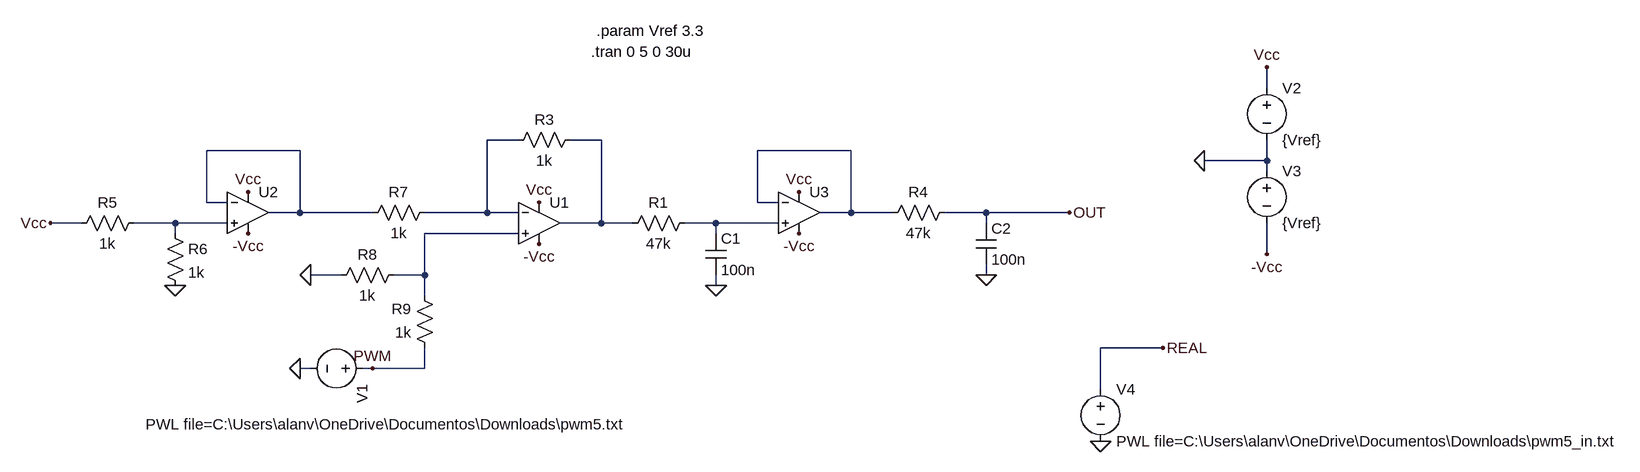
[diagram p0: schematic PWM.asc]
PWM.asc, the LTspice schematic file:
Version 4
SHEET 1 1380 880
WIRE 736 -64 736 -96
WIRE -416 16 -464 16
WIRE -288 16 -336 16
WIRE -752 32 -896 32
WIRE 96 32 -48 32
WIRE 736 48 736 16
WIRE 736 48 640 48
WIRE 736 64 736 48
WIRE -896 112 -896 32
WIRE -864 112 -896 112
WIRE -48 112 -48 32
WIRE -16 112 -48 112
WIRE -752 128 -752 32
WIRE -752 128 -800 128
WIRE -640 128 -752 128
WIRE -464 128 -464 16
WIRE -464 128 -560 128
WIRE -416 128 -464 128
WIRE 96 128 96 32
WIRE 96 128 48 128
WIRE 160 128 96 128
WIRE 304 128 240 128
WIRE 432 128 304 128
WIRE -1088 144 -1136 144
WIRE -944 144 -1008 144
WIRE -864 144 -944 144
WIRE -288 144 -288 16
WIRE -288 144 -352 144
WIRE -240 144 -288 144
WIRE -112 144 -160 144
WIRE -16 144 -112 144
WIRE 304 144 304 128
WIRE -944 160 -944 144
WIRE -416 160 -560 160
WIRE -112 160 -112 144
WIRE 736 192 736 144
WIRE -688 224 -736 224
WIRE -560 224 -560 160
WIRE -560 224 -608 224
WIRE 304 224 304 208
WIRE -112 240 -112 224
WIRE -560 256 -560 224
WIRE 576 336 480 336
WIRE -736 368 -752 368
WIRE -640 368 -656 368
WIRE -560 368 -560 336
WIRE -560 368 -640 368
WIRE 480 400 480 336
FLAG -752 368 0
FLAG -112 240 0
FLAG 640 48 0
FLAG 736 -96 Vcc
FLAG -384 112 Vcc
FLAG 736 192 -Vcc
FLAG -384 176 -Vcc
FLAG -832 96 Vcc
FLAG -832 160 -Vcc
FLAG 304 224 0
FLAG 480 480 0
FLAG 576 336 REAL
FLAG -640 368 PWM
FLAG -944 240 0
FLAG -1136 144 Vcc
FLAG 432 128 OUT
FLAG 16 96 Vcc
FLAG 16 160 -Vcc
FLAG -736 224 0
SYMBOL res -144 128 R90
WINDOW 0 0 56 VBottom 2
WINDOW 3 32 56 VTop 2
SYMATTR InstName R1
SYMATTR Value 47k
SYMBOL cap -128 160 R0
SYMATTR InstName C1
SYMATTR Value 100n
SYMBOL voltage -640 368 R90
WINDOW 3 86 -393 VRight 2
WINDOW 123 0 0 Left 0
WINDOW 39 0 0 Left 0
SYMATTR Value PWL file=C:\Users\alanv\OneDrive\Documentos\Downloads\pwm5.txt
SYMATTR InstName V1
SYMBOL OpAmps\\UniversalOpamp2 -384 144 R0
SYMATTR InstName U1
SYMBOL res -320 0 R90
WINDOW 0 0 56 VBottom 2
WINDOW 3 32 56 VTop 2
SYMATTR InstName R3
SYMATTR Value 1k
SYMBOL voltage 736 -80 R0
WINDOW 123 0 0 Left 0
WINDOW 39 0 0 Left 0
SYMATTR InstName V2
SYMATTR Value {Vref}
SYMBOL voltage 736 48 R0
WINDOW 123 0 0 Left 0
WINDOW 39 0 0 Left 0
SYMATTR InstName V3
SYMATTR Value {Vref}
SYMBOL OpAmps\\UniversalOpamp2 -832 128 R0
SYMATTR InstName U2
SYMBOL res 256 112 R90
WINDOW 0 0 56 VBottom 2
WINDOW 3 32 56 VTop 2
SYMATTR InstName R4
SYMATTR Value 47k
SYMBOL cap 288 144 R0
SYMATTR InstName C2
SYMATTR Value 100n
SYMBOL voltage 480 384 R0
WINDOW 123 0 0 Left 0
WINDOW 39 0 0 Left 0
SYMATTR InstName V4
SYMATTR Value PWL file=C:\Users\alanv\OneDrive\Documentos\Downloads\pwm5_in.txt
SYMBOL res -992 128 R90
WINDOW 0 0 56 VBottom 2
WINDOW 3 32 56 VTop 2
SYMATTR InstName R5
SYMATTR Value 1k
SYMBOL res -960 144 R0
SYMATTR InstName R6
SYMATTR Value 1k
SYMBOL res -656 144 R270
WINDOW 0 32 56 VTop 2
WINDOW 3 0 56 VBottom 2
SYMATTR InstName R7
SYMATTR Value 1k
SYMBOL res -592 208 R90
WINDOW 0 0 56 VBottom 2
WINDOW 3 32 56 VTop 2
SYMATTR InstName R8
SYMATTR Value 1k
SYMBOL res -544 352 R180
WINDOW 0 36 76 Left 2
WINDOW 3 36 40 Left 2
SYMATTR InstName R9
SYMATTR Value 1k
SYMBOL OpAmps\\UniversalOpamp2 16 128 R0
SYMATTR InstName U3
TEXT -304 -120 Left 2 !.tran 0 5 0 30u
TEXT -296 -152 Left 2 !.param Vref 3.3

The netlist it stands for:
* PWM.asc
R1 N006 N002 47k
C1 N006 0 100n
V1 PWM 0 PWL file=C:\Users\alanv\OneDrive\Documentos\Downloads\pwm5.txt
XU1 N007 N001 Vcc -Vcc N002 level.2 Avol=1Meg GBW=10Meg Slew=10Meg ilimit=25m rail=0 Vos=0 phimargin=45 en=0 enk=0 in=0 ink=0 Rin=500Meg  ; pins IN+ IN- V+ V- OUT
R3 N002 N001 1k
V2 Vcc 0 {Vref}
V3 0 -Vcc {Vref}
XU2 N005 N003 Vcc -Vcc N003 level.2 Avol=1Meg GBW=10Meg Slew=10Meg ilimit=25m rail=0 Vos=0 phimargin=45 en=0 enk=0 in=0 ink=0 Rin=500Meg  ; pins IN+ IN- V+ V- OUT
R4 OUT N004 47k
C2 OUT 0 100n
V4 REAL 0 PWL file=C:\Users\alanv\OneDrive\Documentos\Downloads\pwm5_in.txt
R5 N005 Vcc 1k
R6 N005 0 1k
R7 N003 N001 1k
R8 N007 0 1k
R9 PWM N007 1k
XU3 N006 N004 Vcc -Vcc N004 level.2 Avol=1Meg GBW=10Meg Slew=10Meg ilimit=25m rail=0 Vos=0 phimargin=45 en=0 enk=0 in=0 ink=0 Rin=500Meg  ; pins IN+ IN- V+ V- OUT
.tran 0 5 0 30u
.param Vref 3.3
.lib UniversalOpamps2.sub
.backanno
.end